# EAGLE design sumobot (EAGLE 9.6.2)
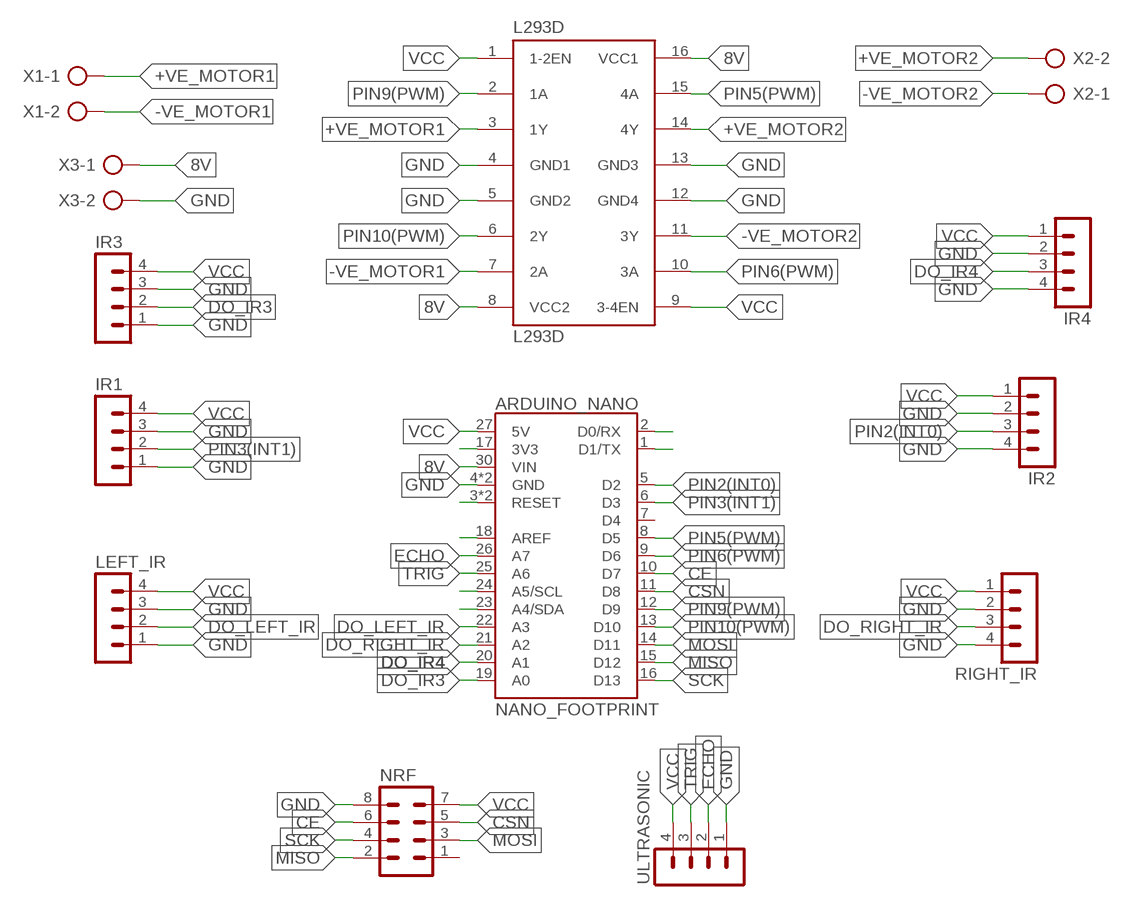
[diagram p0: schematic, sheet 1]

## Parts
ARDUINO_NANO  NANO_FOOTPRINT  [NANO]
IR1  MA04-1  [MA04-1]
IR2  MA04-1  [MA04-1]
IR3  MA04-1  [MA04-1]
IR4  MA04-1  [MA04-1]
L293D  L293D  [DIL16]
LEFT_IR  MA04-1  [MA04-1]
NRF  MA04-2  [MA04-2]
RIGHT_IR  MA04-1  [MA04-1]
ULTRASONIC  MA04-1  [MA04-1]
X1  AK500/2  [AK500/2]
X2  AK500/2  [AK500/2]
X3  AK500/2  [AK500/2]

## Nets
8V: ARDUINO_NANO.30(VIN) L293D.8(VCC2) L293D.16(VCC1) X3.1
+VE_MOTOR1: L293D.3(1Y) X1.1
+VE_MOTOR2: L293D.14(4Y) X2.2
-VE_MOTOR1: L293D.7(2A) X1.2
-VE_MOTOR2: L293D.11(3Y) X2.1
CE: ARDUINO_NANO.10(D7) NRF.6
CSN: ARDUINO_NANO.11(D8) NRF.5
DO_IR3: ARDUINO_NANO.19(A0) IR3.2
DO_IR4: ARDUINO_NANO.20(A1) IR4.3
DO_LEFT_IR: ARDUINO_NANO.22(A3) LEFT_IR.2
DO_RIGHT_IR: ARDUINO_NANO.21(A2) RIGHT_IR.3
ECHO: ARDUINO_NANO.26(A7) ULTRASONIC.2
GND: ARDUINO_NANO.4(GND) ARDUINO_NANO.29(GND) IR1.1 IR1.3 IR2.2 IR2.4 IR3.1 IR3.3 IR4.2 IR4.4 L293D.4(GND1) L293D.5(GND2) L293D.12(GND4) L293D.13(GND3) LEFT_IR.1 LEFT_IR.3 NRF.8 RIGHT_IR.2 RIGHT_IR.4 ULTRASONIC.1 X3.2
MISO: ARDUINO_NANO.15(D12) NRF.2
MOSI: ARDUINO_NANO.14(D11) NRF.3
N$33: ARDUINO_NANO.2(D0/RX)
N$34: ARDUINO_NANO.1(D1/TX)
N$48: ARDUINO_NANO.17(3V3)
N$51: ARDUINO_NANO.3(RESET) ARDUINO_NANO.28(RESET)
N$52: ARDUINO_NANO.18(AREF)
N$55: ARDUINO_NANO.24(A5/SCL)
N$56: ARDUINO_NANO.23(A4/SDA)
PIN2(INT0): ARDUINO_NANO.5(D2) IR2.3
PIN3(INT1): ARDUINO_NANO.6(D3) IR1.2
PIN5(PWM): ARDUINO_NANO.8(D5) L293D.15(4A)
PIN6(PWM): ARDUINO_NANO.9(D6) L293D.10(3A)
PIN9(PWM): ARDUINO_NANO.12(D9) L293D.2(1A)
PIN10(PWM): ARDUINO_NANO.13(D10) L293D.6(2Y)
SCK: ARDUINO_NANO.16(D13) NRF.4
TRIG: ARDUINO_NANO.25(A6) ULTRASONIC.3
VCC: ARDUINO_NANO.27(5V) IR1.4 IR2.1 IR3.4 IR4.1 L293D.1(1-2EN) L293D.9(3-4EN) LEFT_IR.4 NRF.7 RIGHT_IR.1 ULTRASONIC.4
Unconnected: ARDUINO_NANO.7(D4) NRF.1

## Library data of the parts
ARDUINO_NANO = SparkFun-Boards:NANO_FOOTPRINT: Generic Nano Footprint
IR1-IR4 LEFT_IR RIGHT_IR ULTRASONIC = con-lstb:MA04-1: PIN HEADER; OC_FARNELL: unknown; OC_NEWARK: unknown
L293D = st-microelectronics:L293D: PUSH-PULL 4 CHANNEL DRIVER; MPN: L293D; OC_FARNELL: 9589619; OC_NEWARK: 56P8249
NRF = con-lstb:MA04-2: PIN HEADER; OC_FARNELL: unknown; OC_NEWARK: unknown
X1-X3 = con-ptr500:AK500/2: CONNECTOR; OC_FARNELL: unknown; OC_NEWARK: unknown

## Board
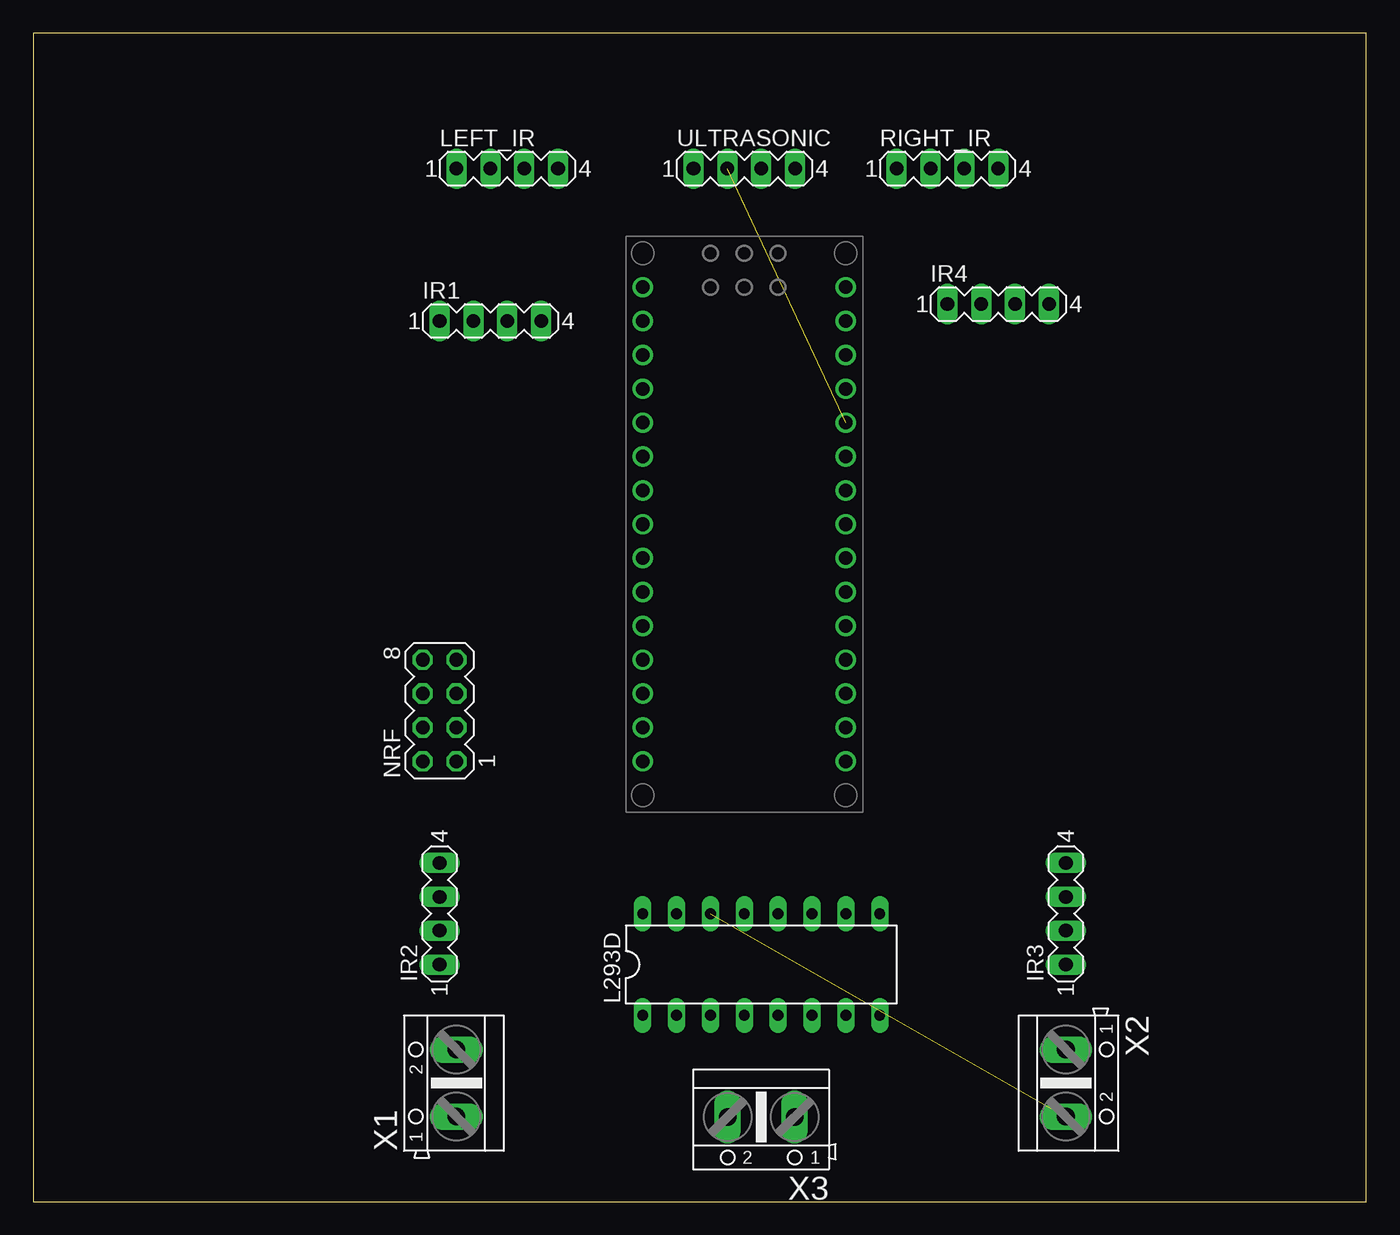
[diagram p1: board, top side]
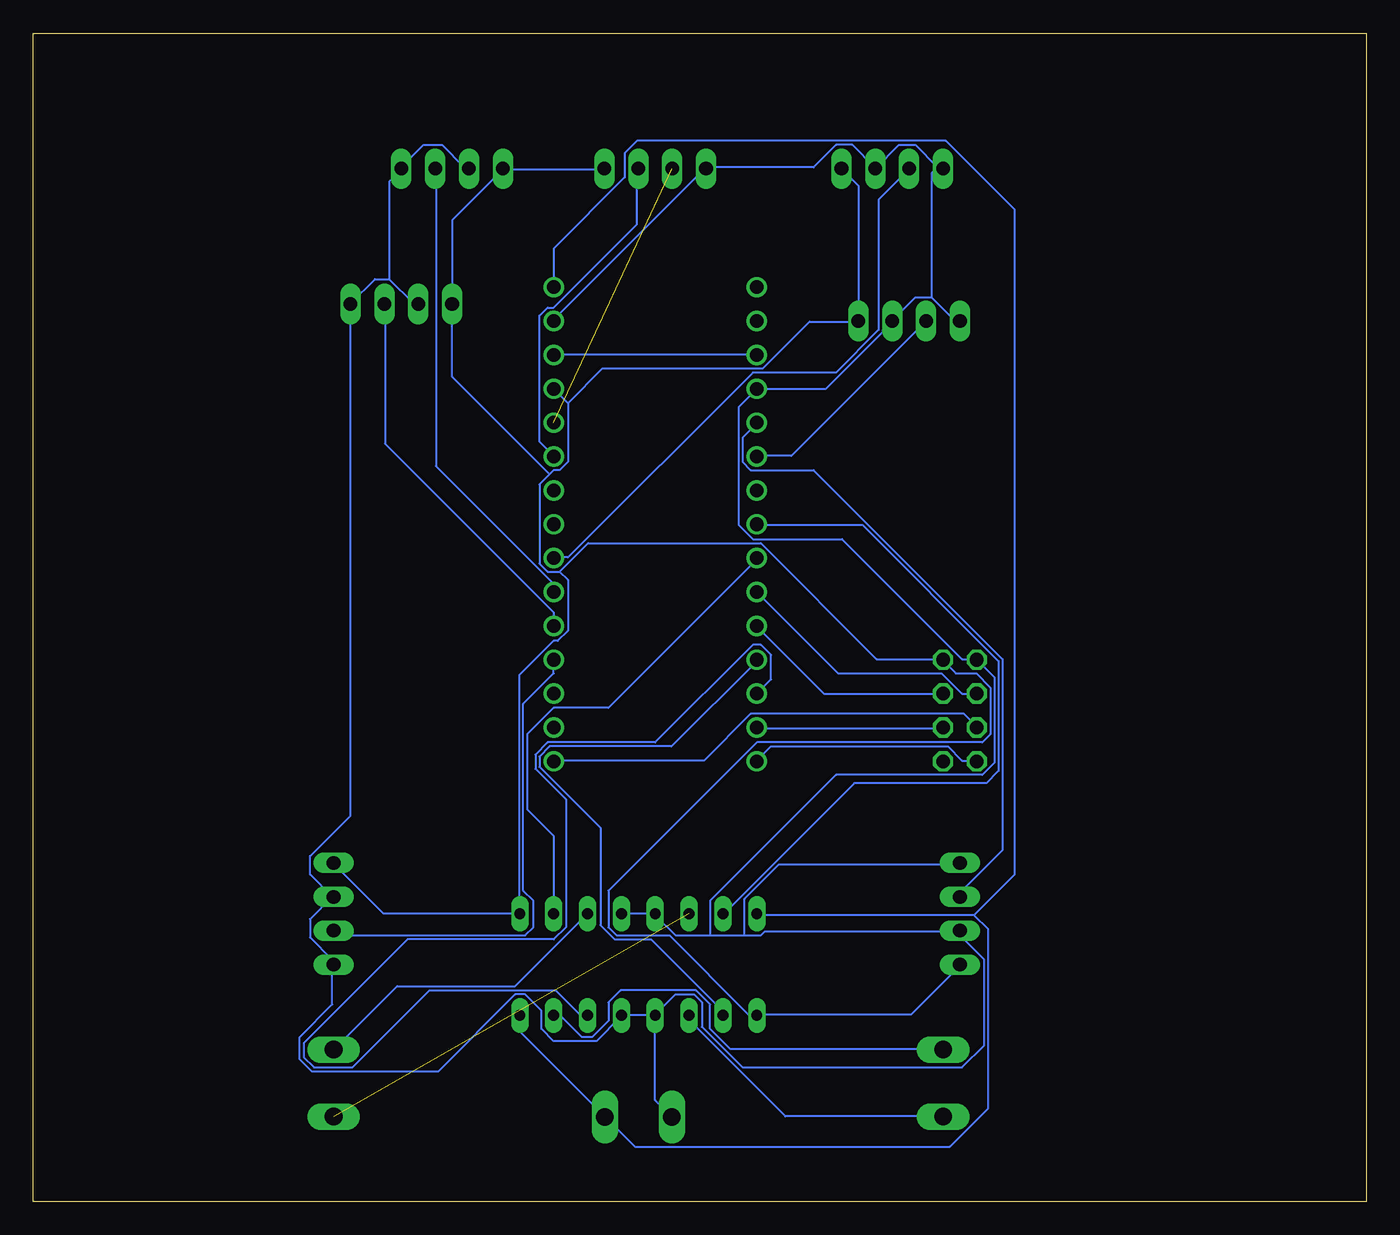
[diagram p2: board, bottom side, seen from below]

Size 100 x 87.62 mm. Coordinates in mm from the lower left corner, seen from the top.
Outline: 0,0 100,0 100,87.62 0,87.62 0,0
Copper layers (1*16): Top 0.035mm / dielectric 1.5mm / Bottom 0.035mm
Design rules "default *": minimum track width 0.8mm, minimum drill 0.8mm, track to track 0.8mm, track to pad 0.8mm, pad to pad 6mil, via to via 6mil, smd to smd 6mil, copper to edge 40mil, drill to drill 6mil, minimum pad ring 10mil, minimum via ring 8mil, stop-mask expansion 4mil, vias tented up to drill 0mil, thermal gap 10mil

### Footprints (pad centres in the part's own frame; a part is rotated, then mirrored left to right if it is on the bottom)
NANO = drill 1.016: 1 -7.62,17.78; 2 -7.62,15.24; 3 -7.62,12.7; 4 -7.62,10.16; 5 -7.62,7.62; 6 -7.62,5.08; 7 -7.62,2.54; 8 -7.62,0; 9 -7.62,-2.54; 10 -7.62,-5.08; 11 -7.62,-7.62; 12 -7.62,-10.16; 13 -7.62,-12.7; 14 -7.62,-15.24; 15 -7.62,-17.78; 16 7.62,-17.78; 17 7.62,-15.24; 18 7.62,-12.7; 19 7.62,-10.16; 20 7.62,-7.62; 21 7.62,-5.08; 22 7.62,-2.54; 23 7.62,0; 24 7.62,2.54; 25 7.62,5.08; 26 7.62,7.62; 27 7.62,10.16; 28 7.62,12.7; 29 7.62,15.24; 30 7.62,17.78
MA04-1 = drill 1.016 long: 1 -3.81,0; 2 -1.27,0; 3 1.27,0; 4 3.81,0
DIL16 = drill 0.813 long: 1 -8.89,-3.81; 2 -6.35,-3.81; 3 -3.81,-3.81; 4 -1.27,-3.81; 5 1.27,-3.81; 6 3.81,-3.81; 7 6.35,-3.81; 8 8.89,-3.81; 9 8.89,3.81; 10 6.35,3.81; 11 3.81,3.81; 12 1.27,3.81; 13 -1.27,3.81; 14 -3.81,3.81; 15 -6.35,3.81; 16 -8.89,3.81
MA04-2 = drill 1.016 octagon: 1 -3.81,-1.27; 2 -3.81,1.27; 3 -1.27,-1.27; 4 -1.27,1.27; 5 1.27,-1.27; 6 1.27,1.27; 7 3.81,-1.27; 8 3.81,1.27
AK500/2 = drill 1.321 long: 1 -2.515,0; 2 2.515,0

### Placement (x,y rotation side)
ARDUINO_NANO  53.34,50.8 0 top
IR1  34.29,66.04 0 top
IR2  30.48,21.59 90 top
IR3  77.47,21.59 90 top
IR4  72.39,67.31 0 top
L293D  54.61,17.78 0 top
LEFT_IR  35.56,77.47 0 top
NRF  30.48,36.83 90 top
RIGHT_IR  68.58,77.47 0 top
ULTRASONIC  53.34,77.47 0 top
X1  31.75,8.89 90 top
X2  77.47,8.89 270 top
X3  54.61,6.35 180 top

### Tracks (layer width: path | path; a pad name or v marks a point on that pad's centre or on a via)
8V
  Bottom 0.152: 29.41,21.49 45.72,21.49 L293D.16 | 29.41,21.49 28.35,20.42 28.35,7.01 31.24,4.12 54.86,4.12 57,6.25 X3.1 57.15,6.4 63.4,12.65 63.4,13.87 L293D.8 | ARDUINO_NANO.30 60.96,71.48 55.63,76.81 55.63,78.64 54.71,79.55 31.55,79.55 26.36,74.37 26.36,24.54 29.41,21.49
+VE_MOTOR1
  Bottom 0.152: L293D.3 50.75,13.87 50.75,13.56 43.59,6.4 31.85,6.4 X1.1
+VE_MOTOR2  (1 unrouted)
-VE_MOTOR1
  Bottom 0.152: L293D.7 60.96,13.87 60.35,13.87 58.83,12.34 58.06,12.34 56.84,13.56 56.84,14.94 55.93,15.85 50.29,15.85 49.23,14.78 49.23,12.95 47.7,11.43 31.85,11.43 X1.2
-VE_MOTOR2
  Bottom 0.152: L293D.11 63.86,16.15 72.69,16.15 77.42,11.43 X2.1
CE
  Bottom 0.152: NRF.6 30.33,38.1 31.85,39.62 39.62,39.62 ARDUINO_NANO.10
CSN
  Bottom 0.152: NRF.5 40.69,38.1 45.72,43.13 ARDUINO_NANO.11
DO_IR3
  Bottom 0.152: ARDUINO_NANO.19 60.96,39.62 63.25,37.34 63.25,23.32 62.48,22.55 62.48,20.57 63.09,19.96 77.11,19.96 IR3.2
DO_IR4
  Bottom 0.152: ARDUINO_NANO.20 60.96,44.2 73.61,56.84 73.61,67.21 IR4.3
DO_LEFT_IR
  Bottom 0.152: ARDUINO_NANO.22 60.96,48.31 59.89,48.31 46.02,62.18 39.78,62.18 36.58,65.38 36.58,75.13 34.29,77.42 LEFT_IR.2
DO_RIGHT_IR
  Bottom 0.152: ARDUINO_NANO.21 60.96,46.33 69.8,55.17 69.8,77.42 RIGHT_IR.3
ECHO  (1 unrouted)
GND
  Bottom 0.152: L293D.12 55.78,21.64 53.34,21.64 L293D.13 53.34,21.49 51.82,19.96 49.23,19.96 | 30.48,20.27 45.11,20.27 45.41,19.96 46.63,19.96 | 49.23,19.96 46.63,19.96 | 46.63,19.96 46.63,22.71 44.04,25.3 30.48,25.3 IR2.4 | 49.53,77.57 60.96,66.14 ARDUINO_NANO.29 | 32.61,67.82 30.94,66.14 30.48,66.14 IR1.1 | 32.61,67.82 33.83,67.82 35.51,66.14 IR1.3 35.66,65.99 36.27,65.38 36.27,65.23 40.54,60.96 ARDUINO_NANO.4 47.09,59.59 47.09,50.75 46.02,49.68 39.32,49.68 30.33,40.69 29.26,40.69 NRF.8 27.89,39.32 27.89,32.92 28.8,32 39.78,32 49.23,22.55 49.23,19.96 | 32.16,77.57 31.85,77.57 LEFT_IR.1 32.16,77.57 | 32.16,77.57 33.83,79.25 35.05,79.25 LEFT_IR.3 36.88,77.57 38.56,79.25 39.78,79.25 41.45,77.57 49.53,77.57 | 32.61,67.82 32.61,77.11 32.16,77.57 | 49.53,77.57 ULTRASONIC.1 | 73.3,69.19 71.48,67.36 71.17,67.36 IR4.2 | 73.3,69.19 74.37,69.19 76.2,67.36 IR4.4 76.2,28.96 79.25,25.91 79.25,24.54 77.57,22.86 | RIGHT_IR.2 67.36,77.57 67.67,77.57 69.34,79.25 70.71,79.25 72.39,77.57 RIGHT_IR.4 72.39,77.42 73.3,76.5 73.3,69.19 | 77.57,22.86 79.25,21.18 79.25,19.81 77.57,18.14 77.57,17.83 IR3.1 77.57,17.68 77.57,14.78 80.01,12.34 80.01,10.67 79.1,9.75 69.65,9.75 63.86,15.54 63.09,15.54 61.87,14.33 61.87,12.95 60.96,12.04 57.76,12.04 55.93,13.87 L293D.5 55.78,14.02 53.34,14.02 | X3.2 52.12,6.4 53.34,7.62 L293D.4 53.34,14.02 | 77.57,22.86 IR3.3 | 30.48,20.27 30.48,19.96 28.65,18.14 28.65,11.73 30.33,10.06 46.79,10.06 49.84,13.11 49.84,14.94 50.44,15.54 51.82,15.54 53.34,14.02 | 30.48,20.27 IR2.2
MISO
  Bottom 0.152: NRF.2 29.26,33.07 30.33,33.07 31.39,34.14 44.65,34.14 45.72,33.07 ARDUINO_NANO.15
MOSI
  Bottom 0.152: NRF.3 31.85,35.51 45.72,35.51 ARDUINO_NANO.14
N$51
  Bottom 0.152: ARDUINO_NANO.3 45.72,63.55 60.96,63.55 ARDUINO_NANO.28
PIN2(INT0)
  Bottom 0.152: IR2.3 30.48,23.16 27.28,26.36 27.28,40.69 41.45,54.86 46.18,54.86 46.79,55.47 46.79,57.3 45.72,58.37 ARDUINO_NANO.5
PIN3(INT1)
  Bottom 0.152: IR1.2 43.13,55.93 45.72,55.93 ARDUINO_NANO.6
PIN5(PWM)
  Bottom 0.152: L293D.15 48.16,21.64 38.41,31.39 28.5,31.39 27.58,32.31 27.58,40.54 37.8,50.75 45.72,50.75 ARDUINO_NANO.8
PIN6(PWM)
  Bottom 0.152: L293D.10 60.96,27.43 62.94,29.41 62.94,35.05 60.96,37.03 56.84,37.03 45.72,48.16 ARDUINO_NANO.9
PIN9(PWM)
  Bottom 0.152: L293D.2 48.31,14.02 48.31,14.33 53.65,19.66 56.39,19.66 57.45,20.73 57.45,28.04 62.03,32.61 62.03,33.38 61.27,34.14 52.12,34.14 45.72,40.54 ARDUINO_NANO.12
PIN10(PWM)
  Bottom 0.152: ARDUINO_NANO.13 44.65,39.17 44.65,41 45.41,41.76 46.02,41.76 53.34,34.44 61.42,34.44 62.33,33.53 62.33,32.46 60.05,30.18 60.05,20.57 60.96,19.66 71.93,19.66 79.7,11.89 79.7,10.82 78.94,10.06 76.05,10.06 70.26,15.85 60.81,15.85 58.98,14.02 58.52,14.02 L293D.6
SCK
  Bottom 0.152: ARDUINO_NANO.16 60.96,33.07 49.68,33.07 46.18,36.58 30.18,36.58 29.26,35.66 NRF.4
TRIG
  Bottom 0.152: ULTRASONIC.3 54.71,77.42 54.71,73.3 60.96,67.06 61.42,67.06 62.03,66.45 62.03,57 60.96,55.93 ARDUINO_NANO.25
VCC
  Bottom 0.152: 64.77,77.42 57.15,77.42 ULTRASONIC.4 | 64.77,77.42 68.58,73.61 IR4.1 68.58,61.87 61.27,54.56 | 64.77,77.42 RIGHT_IR.1 | 45.72,14.02 34.14,14.02 30.48,17.68 IR2.1 | 63.55,21.64 73.76,21.64 77.42,25.3 IR3.4 | LEFT_IR.4 38.1,76.2 IR1.4 38.1,65.99 41.76,65.99 45.26,62.48 57.3,62.48 59.89,59.89 | 60.5,47.24 58.37,49.38 45.41,49.38 36.73,40.69 31.85,40.69 NRF.7 31.7,40.54 30.79,39.62 29.26,39.62 28.19,38.56 28.19,35.05 28.8,34.44 45.72,34.44 56.84,23.32 56.84,20.57 56.24,19.96 52.27,19.96 46.33,14.02 45.72,14.02 | 60.5,47.24 61.42,47.24 62.03,47.85 62.03,53.8 61.27,54.56 | 61.27,54.56 60.96,54.86 60.5,54.86 59.89,55.47 59.89,59.89 | ARDUINO_NANO.27 59.89,59.89 | 63.55,21.64 63.55,39.47 60.96,42.06 60.66,42.06 59.89,42.82 59.89,46.63 60.5,47.24 | 63.55,21.64 L293D.9 | 45.72,14.02 L293D.1